# Altium schematic sheet 6_ESP12_F.SchDoc
size A4; SheetNumber: 9; SheetTotal: 12
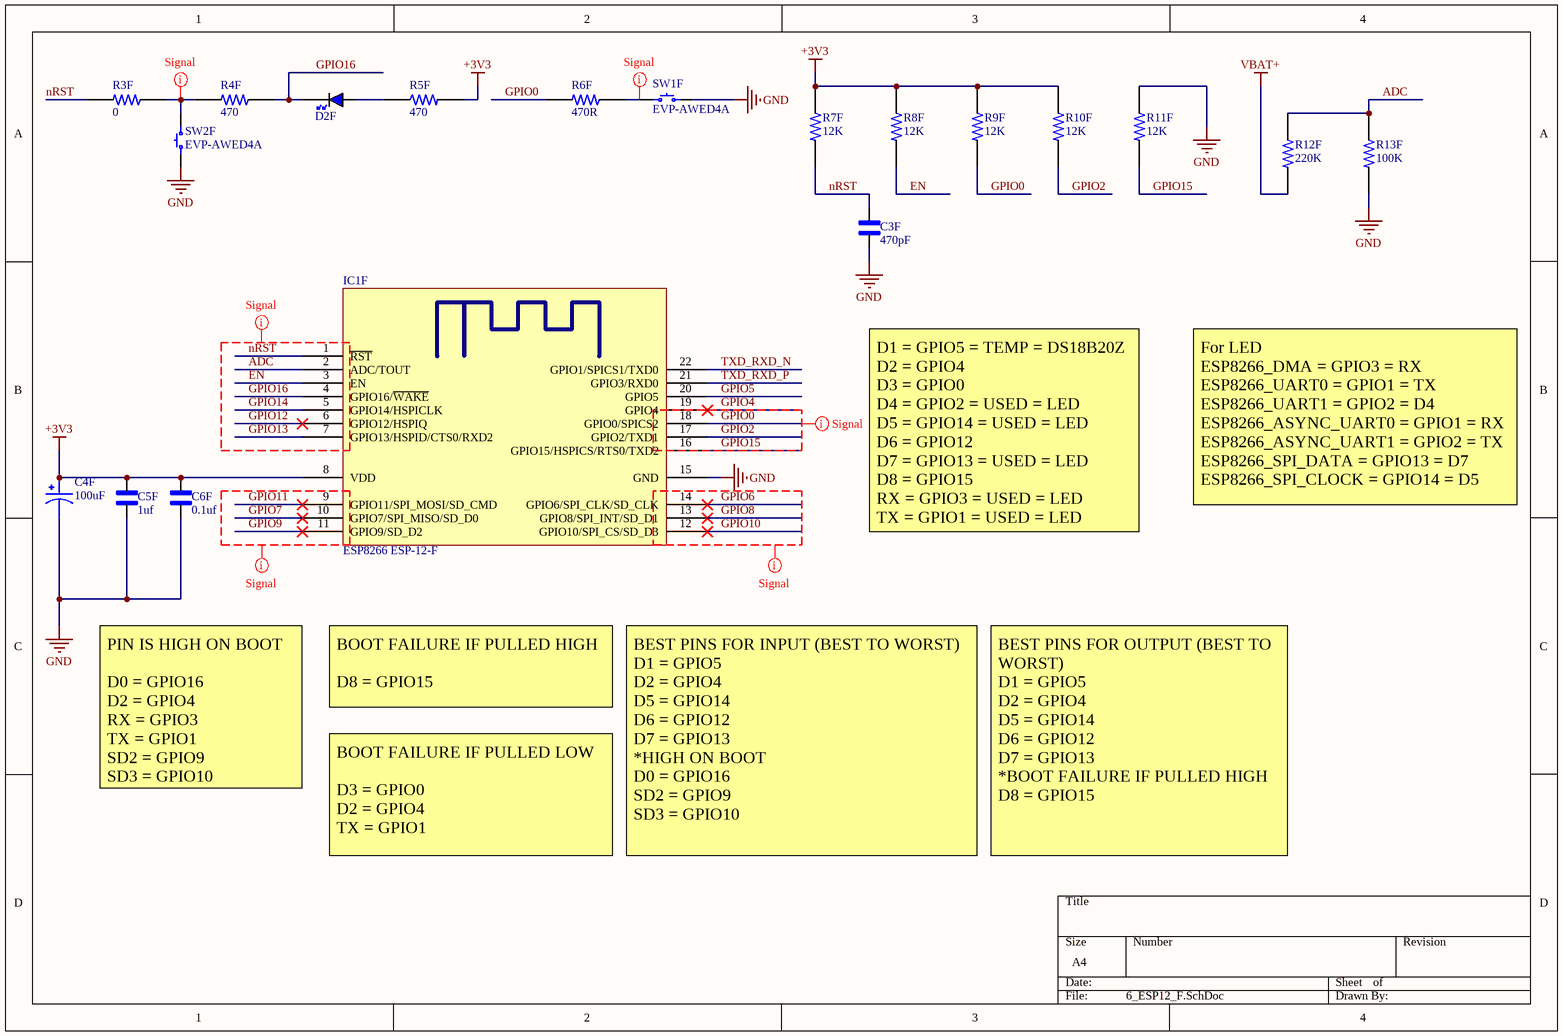
[diagram p0: 6_ESP12_F.SchDoc]

## Parts
C3F  470pF  [C-0603]
C4F  100uF  [1411-3528]
C5F  1uf  [C-0603]
C6F  0.1uf  [C-0603]
D2F  BLUE  [LED_0603_BLUE]  (value not drawn)
IC1F  ESP8266 ESP-12-F  [ESP8266 ESP-12-F]
R3F  0  [R-0603]
R4F  470  [R-0603]
R5F  470  [R-0603]
R6F  470R  [R-0603]
R7F  12K  [R-0603]
R8F  12K  [R-0603]
R9F  12K  [R-0603]
R10F  12K  [R-0603]
R11F  12K  [R-0603]
R12F  220K  [R-0603]
R13F  100K  [R-0603]
SW1F  EVP-AWED4A  [PANASONIC EVPAW]
SW2F  EVP-AWED4A  [PANASONIC EVPAW]

## Nets
+3V3: C4F.1 C5F.2 C6F.2 IC1F.8(VDD) R5F.2 R7F.1 R8F.1 R9F.1 R10F.1
GND: C3F.1 C4F.2 C5F.1 C6F.1 IC1F.15(GND) R11F.1 R13F.2 SW1F.2 SW2F.1
VBAT+: R12F.2
ADC: IC1F.2(ADC/TOUT) R12F.1 R13F.1
EN: IC1F.3(EN) R8F.2
GPIO0: IC1F.18(GPIO0/SPICS2) R6F.2 R9F.2
GPIO2: IC1F.17(GPIO2/TXD1) R10F.2
GPIO4: IC1F.19(GPIO4)
GPIO5: IC1F.20(GPIO5)
GPIO6: IC1F.14(GPIO6/SPI_CLK/SD_CLK)
GPIO7: IC1F.10(GPIO7/SPI_MISO/SD_D0)
GPIO8: IC1F.13(GPIO8/SPI_INT/SD_D1)
GPIO9: IC1F.11(GPIO9/SD_D2)
GPIO10: IC1F.12(GPIO10/SPI_CS/SD_D3)
GPIO11: IC1F.9(GPIO11/SPI_MOSI/SD_CMD)
GPIO12: IC1F.6(GPIO12/HSPIQ)
GPIO13: IC1F.7(GPIO13/HSPID/CTS0/RXD2)
GPIO14: IC1F.5(GPIO14/HSPICLK)
GPIO15: IC1F.16(GPIO15/HSPICS/RTS0/TXD2) R11F.2
GPIO16: D2F.K IC1F.4(GPIO16/~{WAKE}) R4F.1
nRST: C3F.2 IC1F.1(~{RST}) R3F.2 R7F.2
TXD_RXD_N: IC1F.22(GPIO1/SPICS1/TXD0)
TXD_RXD_P: IC1F.21(GPIO3/RXD0)
NetD2F_A: D2F.A R5F.1
NetR3F_1: R3F.1 R4F.2 SW2F.2
NetR6F_1: R6F.1 SW1F.1

## Layout directives
net class Signal: ADC, EN, GPIO0, GPIO6, GPIO7, GPIO8, GPIO9, GPIO10, GPIO11, GPIO12, GPIO13, GPIO14, GPIO16, NetR3F_1, NetR6F_1, nRST

## Notes on the sheet
- For LED
  ESP8266_DMA = GPIO3 = RX
  ESP8266_UART0 = GPIO1 = TX
  ESP8266_UART1 = GPIO2 = D4
  ESP8266_ASYNC_UART0 = GPIO1 = RX
  ESP8266_ASYNC_UART1 = GPIO2 = TX
  ESP8266_SPI_DATA = GPIO13 = D7
  ESP8266_SPI_CLOCK = GPIO14 = D5
- D1 = GPIO5 = TEMP = DS18B20Z
  D2 = GPIO4
  D3 = GPIO0
  D4 = GPIO2 = USED = LED
  D5 = GPIO14 = USED = LED
  D6 = GPIO12
  D7 = GPIO13 = USED = LED
  D8 = GPIO15
  RX = GPIO3 = USED = LED
  TX = GPIO1 = USED = LED
- BOOT FAILURE IF PULLED HIGH
  D8 = GPIO15
- PIN IS HIGH ON BOOT
  D0 = GPIO16
  D2 = GPIO4
  RX = GPIO3
  TX = GPIO1
  SD2 = GPIO9
  SD3 = GPIO10
- BOOT FAILURE IF PULLED LOW
  D3 = GPIO0
  D2 = GPIO4
  TX = GPIO1
- BEST PINS FOR INPUT (BEST TO WORST)
  D1 = GPIO5
  D2 = GPIO4
  D5 = GPIO14
  D6 = GPIO12
  D7 = GPIO13
  *HIGH ON BOOT
  D0 = GPIO16
  SD2 = GPIO9
  SD3 = GPIO10
- BEST PINS FOR OUTPUT (BEST TO WORST)
  D1 = GPIO5
  D2 = GPIO4
  D5 = GPIO14
  D6 = GPIO12
  D7 = GPIO13
  *BOOT FAILURE IF PULLED HIGH
  D8 = GPIO15

## Library data of the parts
C3F C5F C6F = C-0603: Ceramic Capacitor 16V 0603 (1608 Metric); MP: C0603C104J4RAC; MF: KEMET; SnapEDA_Link: https://www.snapeda.com/parts/C0603C104J4RAC/KEMET/view-part/1763758/?ref=snap; Availability: Warning; Package: 0603 KEMET; Check_prices: https://www.snapeda.com/parts/C0603C104J4RAC/KEMET/view-part/1763758/?ref=eda; Value: *; Price: None
C4F = C-1411 (3528 Metric): Molded Tantalum Capacitors 16V 1411 (3528 Metric); MF: KEMET; MP: T495B106K025ATE750; Package: 1411 KEMET; Value: *; Availability: Unavailable; SnapEDA_Link: https://www.snapeda.com/parts/T495B106K025ATE750/KEMET/view-part/1680496/?ref=snap; Price: None
D2F = LED_0603_BLUE: LED 0603 BLUE SMD
R3F R4F R5F R6F R7F R8F R9F R10F R11F R12F R13F = R-0603: 0603; MP: 2-1623703-0; Power_Rating: .1 W; Value: 10K; Tolerance: 1%; MF: TE Connectivity; Package: 0603; Price: None; Resistance: 10K; Check_prices: https://www.snapeda.com/parts/2-1623703-0/TE%20Connectivity/view-part/2213192/?ref=eda; SnapEDA_Link: https://www.snapeda.com/parts/2-1623703-0/TE%20Connectivity/view-part/2213192/?ref=snap; Availability: Warning
SW1F SW2F = EVP-AWED4A: 3.0MM X 2.0MM / 3.3N / 0.15MM ST; Manufacturer: Panasonic Electronic Components; Actuator Height off PCB, Vertical: 0.60mm; Actuator Orientation: Top Actuated; Actuator Type: Standard; Circuit: SPST-NO; Contact Rating @ Voltage: 0.02A @ 15VDC; Illumination: Non-Illuminated; Ingress Protection: IP67 - Dust Tight, Waterproof; Operating Force: 330gf; Outline: 3.00mm x 2.00mm; Switch Function: Off-Mom; Part Number: EVP-AWED4A; ComponentLink1Description: Datasheet; ComponentLink1URL: https://industrial.panasonic.com/ac/cdn/e/control/switch/light-touch/catalog/sw_lt_eng_3020s.pdf; ComponentLink2Description: DigiKey Link; ComponentLink2URL: https://www.digikey.com/en/products/detail/panasonic-electronic-components/EVP-AWED4A/8568275; LastUpdated: 29-12-2022 09:10:40 PM; Lifecycle Status: Active; Minimum Order: 1; Mounting Type: Surface Mount; Operating Temperature: -40°C ~ 85°C; Packaging: TapeAndReel; Part Status: Active; Price: 0.16; Series: EVPAW; Supplier 1: DigiKey; Supplier Part Number 1: P123440CT-ND; Termination Style: SMD (SMT) Tab